# Altium schematic sheet Copy of component_layout.SchDoc
size A4; SheetNumber: 1; SheetTotal: 1
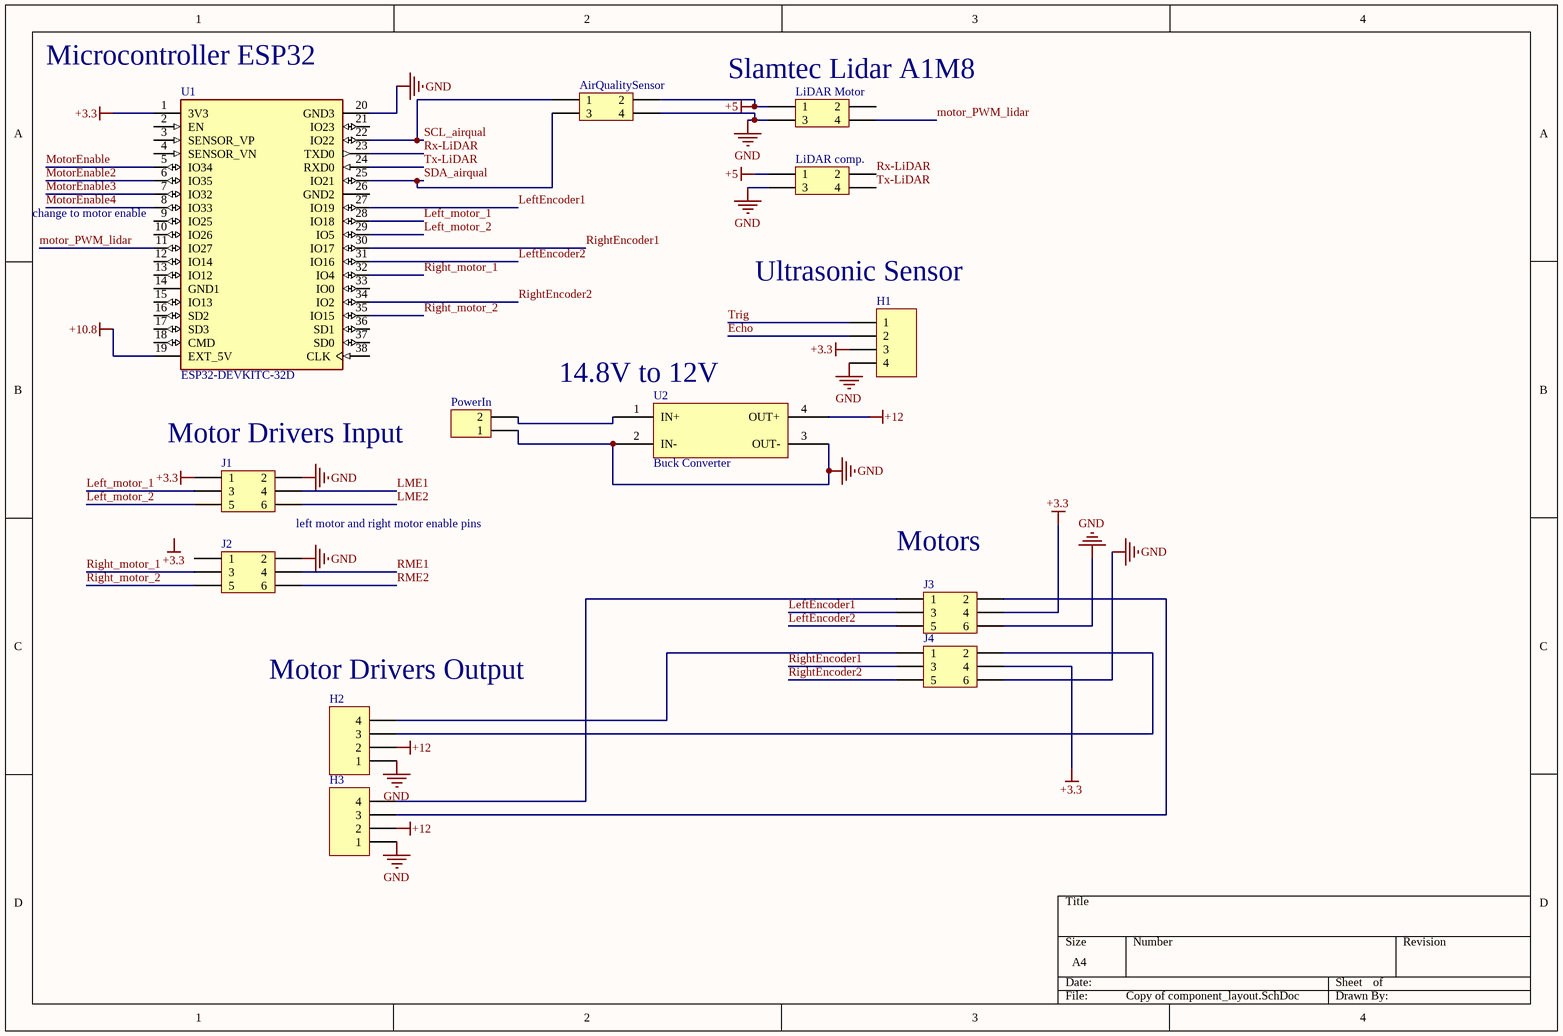
[diagram p0: Copy of component_layout.SchDoc]

## Parts
AirQualitySensor  HEADER  [HDR2X2]  (value not drawn)
H1  Header 4  [HDR1X4]  (value not drawn)
H2  Header 4  [HDR1X4]  (value not drawn)
H3  Header 4  [HDR1X4]  (value not drawn)
J1  HEADER  [HDR2X3]  (value not drawn)
J2  HEADER  [HDR2X3]  (value not drawn)
J3  HEADER  [HDR2X3]  (value not drawn)
J4  HEADER  [HDR2X3]  (value not drawn)
LiDAR_comp.  HEADER  [HDR2X2]  (value not drawn)
LiDAR_Motor  HEADER  [HDR2X2]  (value not drawn)
PowerIn  Header 2  [HDR1X2]  (value not drawn)
U1  ESP32-DEVKITC-32D  [MODULE_ESP32-DEVKITC-32D]
U2  Buck Converter  [Buck Converter]

## Nets
+3.3: H1.3 J1.1 J3.4 J4.4 U1.1(3V3)
+5: AirQualitySensor.2 LiDAR_comp..1 LiDAR_Motor.1
+10.8: U1.19(EXT_5V)
+12: H2.2 H3.2 U2.4(OUT+)
GND: AirQualitySensor.4 H1.4 H2.1 H3.1 J1.2 J2.2 J3.6 J4.6 LiDAR_comp..3 LiDAR_Motor.3 PowerIn.1 U1.20(GND3) U2.2(IN-) U2.3(OUT-)
Echo: H1.2
Left_motor_1: J1.3 U1.28(IO18)
Left_motor_2: J1.5 U1.29(IO5)
LeftEncoder1: J3.3 U1.27(IO19)
LeftEncoder2: J3.5 U1.31(IO16)
LME1: J1.4
LME2: J1.6
motor_PWM_lidar: LiDAR_Motor.4 U1.11(IO27)
MotorEnable: U1.5(IO34)
MotorEnable2: U1.6(IO35)
MotorEnable3: U1.7(IO32)
MotorEnable4: U1.8(IO33)
Right_motor_1: J2.3 U1.32(IO4)
Right_motor_2: J2.5 U1.35(IO15)
RightEncoder1: J4.3 U1.30(IO17)
RightEncoder2: J4.5 U1.34(IO2)
RME1: J2.4
RME2: J2.6
Rx-LiDAR: LiDAR_comp..2 U1.23(TXD0)
SCL_airqual: AirQualitySensor.1 U1.22(IO22)
SDA_airqual: AirQualitySensor.3 U1.25(IO21)
Trig: H1.1
Tx-LiDAR: LiDAR_comp..4 U1.24(RXD0)
NetH2_3: H2.3 J4.2
NetH2_4: H2.4 J4.1
NetH3_3: H3.3 J3.2
NetH3_4: H3.4 J3.1
NetPowerIn_2: PowerIn.2 U2.1(IN+)

Not connected (* = marked no-connect by the designer): J2 1; LiDAR_Motor 2; U1 2(EN) 3(SENSOR_VP) 4(SENSOR_VN) 9(IO25) 10(IO26) 12(IO14) 13(IO12) 14(GND1) 15(IO13) 16(SD2) 17(SD3) 18(CMD) 21(IO23) 26(GND2) 33(IO0) 36(SD1) 37(SD0) 38(CLK)

## Notes on the sheet
- (near U1) Microcontroller ESP32
- (near LiDAR_Motor) Slamtec Lidar A1M8
- (near U1) change to motor enable
- (near H1) Ultrasonic Sensor
- (near U2) 14.8V to 12V
- (near J1) Motor Drivers Input
- left motor and right motor enable pins
- (near J3) Motors
- (near H2) Motor Drivers Output
- Labels drawn without touching a wire or pin: +3.3

## Library data of the parts
AirQualitySensor LiDAR_comp. LiDAR_Motor = Header 2x2: Header, 5-Pin, Dual row; Revision: 17-Jul-2002: Re-released for DXP Platform.; Publisher: Altium Limited
H1-H3 = Header 4: Header, 4-Pin; Manufacturer: Generic Components; Class: Connector
J1-J4 = Header 2x3: Header, 5-Pin, Dual row; Revision: 17-Jul-2002: Re-released for DXP Platform.; Publisher: Altium Limited
PowerIn = Header 2: Header, 2-Pin; Manufacturer: Generic Components; Class: Connector
U1 = ESP32-DEVKITC-32D: WiFi Development Tools (802.11) ESP32 General Development Kit, ESP32-WROOM-32D on the board; MF: Espressif Systems; Price: None; Availability: In Stock; MP: ESP32-DEVKITC-32D; Package: None; SnapEDA_Link: https://www.snapeda.com/parts/ESP32-DEVKITC-32D/Espressif+Systems/view-part/?ref=snap; Check_prices: https://www.snapeda.com/parts/ESP32-DEVKITC-32D/Espressif+Systems/view-part/?ref=eda; Value: *; Purchase-URL: https://pricing.snapeda.com/search/part/ESP32-DEVKITC-32D/?ref=eda
U2 = Buck Converter: Buck Convertor